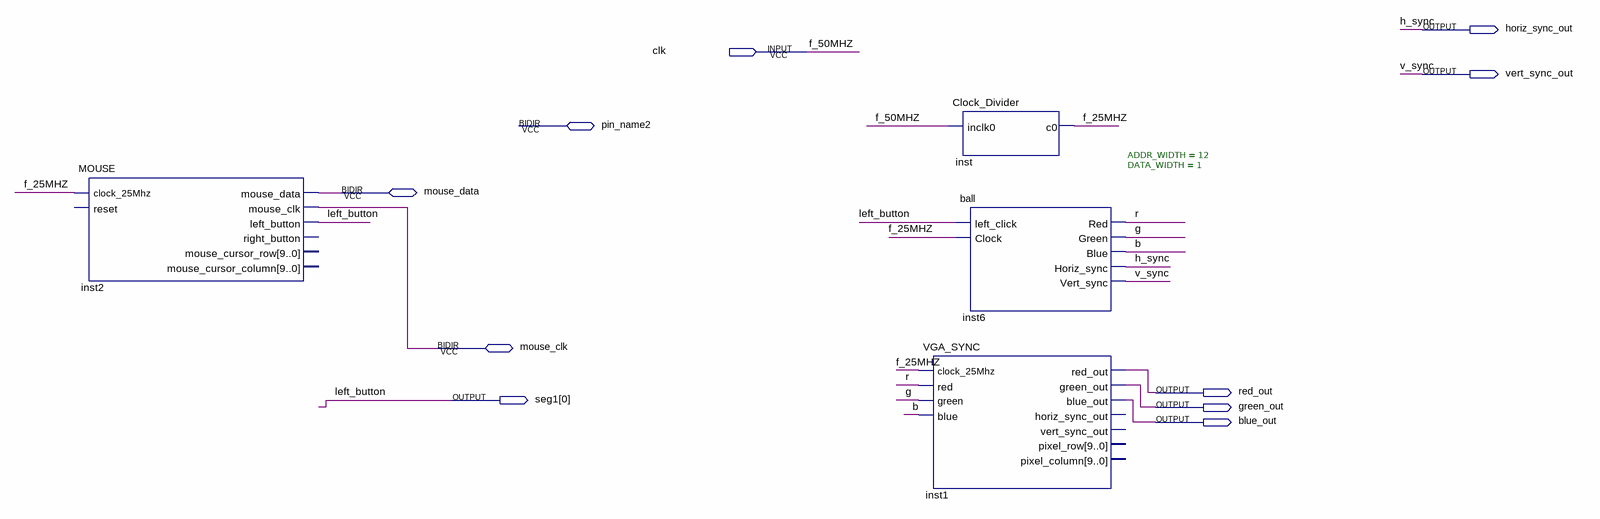
[diagram p0: schematic sheet]
// Quartus schematic Ball1.bdf as structural Verilog: 4 symbols, 10 pins
module Ball1 (
  input  clk,
  inout  pin_name2,
  inout  mouse_data,
  inout  mouse_clk,
  output horiz_sync_out,
  output vert_sync_out,
  output red_out,
  output [0:0] seg1,
  output green_out,
  output blue_out
);

  wire b, f_25MHZ, g, r;

  MOUSE inst2 (
    .clock_25Mhz(f_25MHZ), .left_button(seg1[0]), .mouse_data(mouse_data), .mouse_clk(mouse_clk));  // open: reset, right_button, mouse_cursor_row, mouse_cursor_column
  Clock_Divider inst (.inclk0(clk), .c0(f_25MHZ));
  VGA_SYNC inst1 (
    .clock_25Mhz(f_25MHZ), .red(r), .green(g), .blue(b), .red_out(red_out), .green_out(green_out),
    .blue_out(blue_out));  // open: horiz_sync_out, vert_sync_out, pixel_row, pixel_column
  ball #(.ADDR_WIDTH(12), .DATA_WIDTH(1)) inst6 (
    .left_click(seg1[0]), .Clock(f_25MHZ), .Red(r), .Green(g), .Blue(b), .Horiz_sync(horiz_sync_out),
    .Vert_sync(vert_sync_out));

  // Other names for the same wires on the sheet: f_50MHZ = clk; h_sync = horiz_sync_out; left_button = seg1[0];
  //   v_sync = vert_sync_out
endmodule
